# Altium schematic sheet Sheet.SchDoc
size A4
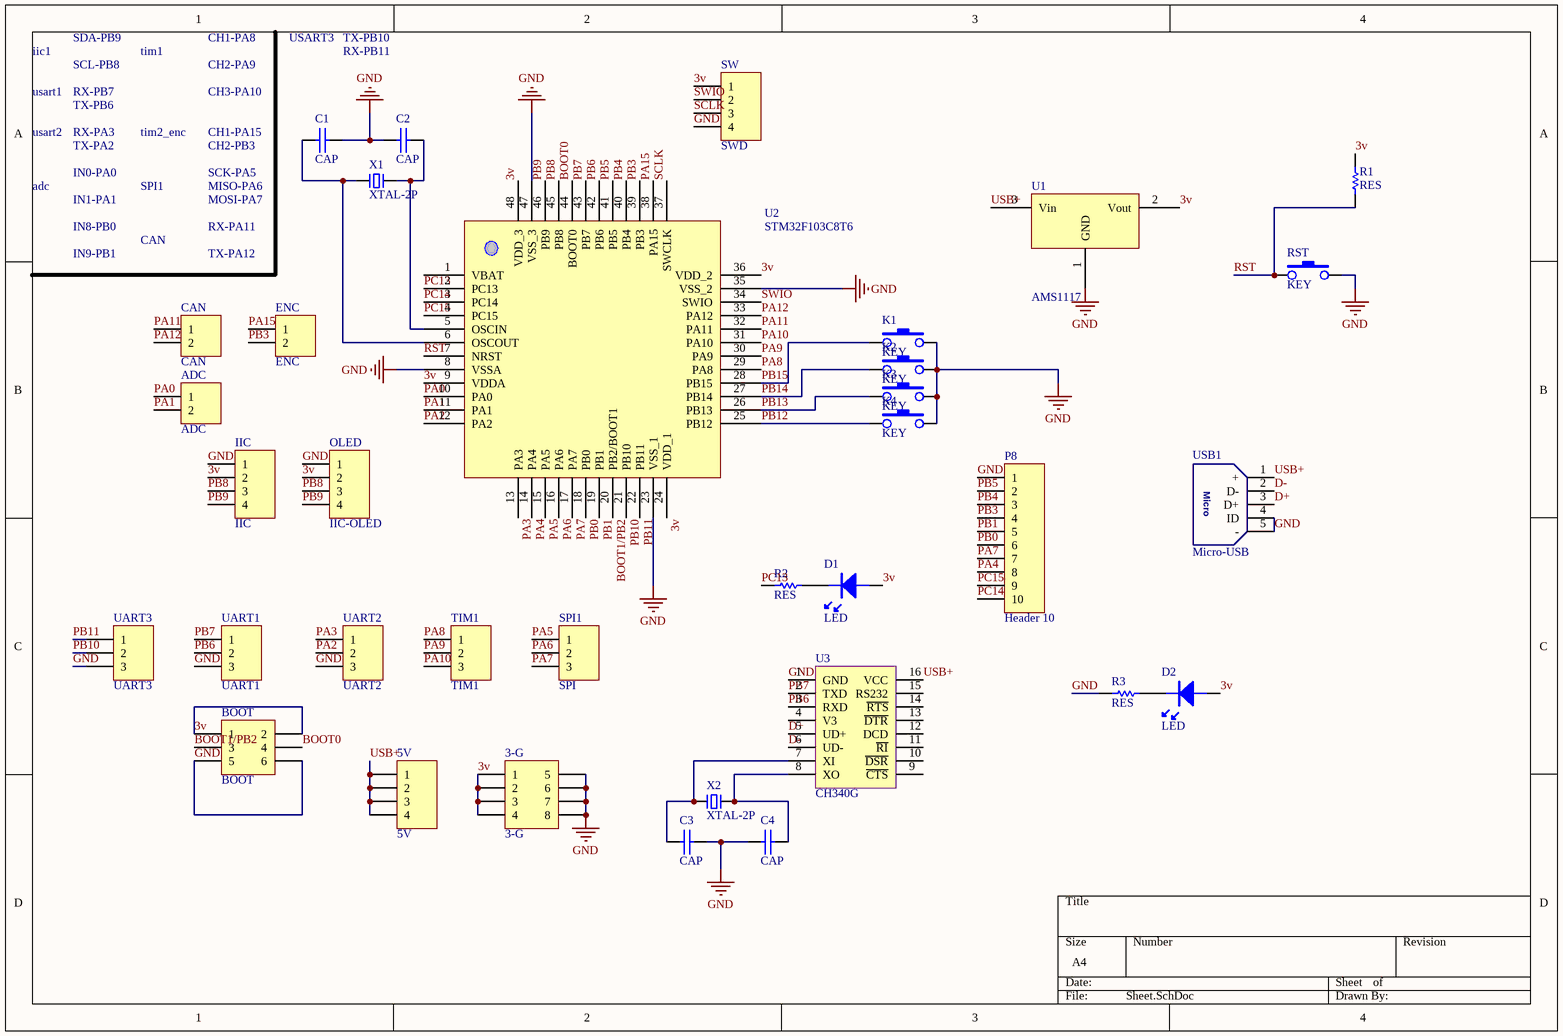
[diagram p0: Sheet.SchDoc]

## Parts
3-G  3-G  [HDR2X4_CEN]
5V  5V  [HDR1X4]
ADC  ADC  [HDR1X2]
BOOT  BOOT  [HDR2X3]
C1  CAP  [0603C]
C2  CAP  [0603C]
C3  CAP  [0603C]
C4  CAP  [0603C]
CAN  CAN  [HDR1X2]
D1  LED  [LED-0603B]
D2  LED  [LED-0603B]
ENC  ENC  [HDR1X2]
IIC  IIC  [HDR1X4]
K1  KEY  [DIP-3X6X4.3]
K2  KEY  [DIP-3X6X4.3]
K3  KEY  [DIP-3X6X4.3]
K4  KEY  [DIP-3X6X4.3]
OLED  IIC-OLED  [HDR1X4]
P8  Header 10  [HDR1X10]
R1  RES  [0603R]
R2  RES  [0603R]
R3  RES  [0603R]
RST  KEY  [DIP-3X6X4.3]
SPI1  SPI  [HDR1X3]
SW  SWD  [HDR1X4]
TIM1  TIM1  [HDR1X3]
U1  AMS1117  [SOT223]
U2  STM32F103C8T6  [48P]
U3  CH340G  [SOP16]
UART1  UART1  [HDR1X3]
UART2  UART2  [HDR1X3]
UART3  UART3  [HDR1X3H]
USB1  Micro-USB  [USB-MICRO_A]
X1  XTAL-2P  [OSC HC-49S]
X2  XTAL-2P  [OSC HC-49S]

## Nets
GND: 3-G.5 3-G.6 3-G.7 3-G.8 BOOT.5 BOOT.6 C1.1 C2.2 C3.2 C4.1 IIC.1 K1.3 K2.3 K3.3 K4.3 OLED.1 P8.1 R3.1 RST.3 SW.4 U1.1(GND) U2.8(VSSA) U2.23(VSS_1) U2.35(VSS_2) U2.47(VSS_3) U3.1(GND) UART1.3 UART2.3 UART3.3 USB1.4(ID) USB1.5(-)
3v: 3-G.1 3-G.2 3-G.3 3-G.4 BOOT.1 BOOT.2 D1.A D2.A IIC.2 OLED.2 R1.2 SW.1 U1.2(Vout) U2.9(VDDA) U2.24(VDD_1) U2.36(VDD_2) U2.48(VDD_3)
BOOT0: BOOT.4 U2.44(BOOT0)
BOOT1/PB2: BOOT.3 U2.20(PB2/BOOT1)
D+: U3.5(UD+) USB1.3(D+)
D-: U3.6(UD-) USB1.2(D-)
PA0: ADC.1 U2.10(PA0)
PA1: ADC.2 U2.11(PA1)
PA2: U2.12(PA2) UART2.2
PA3: U2.13(PA3) UART2.1
PA4: P8.8 U2.14(PA4)
PA5: SPI1.1 U2.15(PA5)
PA6: SPI1.2 U2.16(PA6)
PA7: P8.7 SPI1.3 U2.17(PA7)
PA8: TIM1.1 U2.29(PA8)
PA9: TIM1.2 U2.30(PA9)
PA10: TIM1.3 U2.31(PA10)
PA11: CAN.1 U2.32(PA11)
PA12: CAN.2 U2.33(PA12)
PA15: ENC.1 U2.38(PA15)
PB0: P8.6 U2.18(PB0)
PB1: P8.5 U2.19(PB1)
PB3: ENC.2 P8.4 U2.39(PB3)
PB4: P8.3 U2.40(PB4)
PB5: P8.2 U2.41(PB5)
PB6: U2.42(PB6) U3.3(RXD) UART1.2
PB7: U2.43(PB7) U3.2(TXD) UART1.1
PB8: IIC.3 OLED.3 U2.45(PB8)
PB9: IIC.4 OLED.4 U2.46(PB9)
PB10: U2.21(PB10) UART3.2
PB11: U2.22(PB11) UART3.1
PB12: K4.1 U2.25(PB12)
PB13: K3.1 U2.26(PB13)
PB14: K2.1 U2.27(PB14)
PB15: K1.1 U2.28(PB15)
PC13: R2.1 U2.2(PC13)
PC14: P8.10 U2.3(PC14)
PC15: P8.9 U2.4(PC15)
RST: R1.1 RST.1 U2.7(NRST)
SCLK: SW.3 U2.37(SWCLK)
SWIO: SW.2 U2.34(SWIO)
USB+: 5V.1 5V.2 5V.3 5V.4 U1.3(Vin) U3.16(VCC) USB1.1(+)
NetC1_2: C1.2 U2.6(OSCOUT) X1.2
NetC2_1: C2.1 U2.5(OSCIN) X1.1
NetC3_1: C3.1 U3.7(XI) X2.1
NetC4_2: C4.2 U3.8(XO) X2.2
NetD1_K: D1.K R2.2
NetD2_K: D2.K R3.2

Not connected (* = marked no-connect by the designer): U2 1(VBAT); U3 4(V3) 9(~{CTS}) 10(~{DSR}) 11(~{RI}) 12(DCD) 13(~{DTR}) 14(~{RTS}) 15(RS232)

## Notes on the sheet
- SDA-PB9
- CH1-PA8
- USART3
- TX-PB10
- iic1
- usart1
- SCL-PB8
- RX-PB7
- TX-PB6
- tim1
- CH2-PA9
- CH3-PA10
- RX-PB11
- usart2
- RX-PA3
- TX-PA2
- IN0-PA0
- tim2_enc
- CH1-PA15
- CH2-PB3
- SCK-PA5
- adc
- IN1-PA1
- IN8-PB0
- SPI1
- CAN
- MISO-PA6
- MOSI-PA7
- RX-PA11
- IN9-PB1
- TX-PA12
- (in symbol Micro-USB) Micro

## Library data of the parts
3-G = Header 4X2A: Header, 4-Pin, Dual row; LatestRevisionDate: 17-Jul-2002; LatestRevisionNote: Re-released for DXP Platform.; Publisher: Altium Limited
5V IIC OLED SW = Header 4: Header, 4-Pin; LatestRevisionDate: 17-Jul-2002; LatestRevisionNote: Re-released for DXP Platform.; Publisher: Altium Limited
ADC CAN ENC = Header 2: Header, 2-Pin; LatestRevisionDate: 17-Jul-2002; LatestRevisionNote: Re-released for DXP Platform.; Publisher: Altium Limited
BOOT = Header 3X2: Header, 3-Pin, Dual row; LatestRevisionDate: 17-Jul-2002; LatestRevisionNote: Re-released for DXP Platform.; Publisher: Altium Limited
C1-C4 = CAP: 无极性电容
P8 = Header 10: Header, 10-Pin; LatestRevisionDate: 17-Jul-2002; LatestRevisionNote: Re-released for DXP Platform.; Publisher: Altium Limited
SPI1 TIM1 UART1 UART2 = Header 3: Header, 3-Pin; LatestRevisionDate: 17-Jul-2002; LatestRevisionNote: Re-released for DXP Platform.; Publisher: Altium Limited
U1 = AMS1117: 三端稳压芯片
UART3 = Header 3H: Header, 3-Pin, Right Angle; LatestRevisionDate: 17-Jul-2002; LatestRevisionNote: Re-released for DXP Platform.; Publisher: Altium Limited
X1 X2 = XTAL-2P: 2脚无源脚晶振